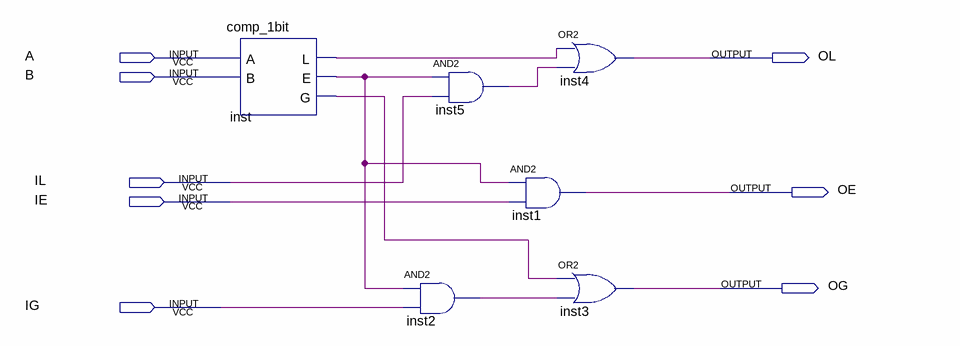
[diagram p0: schematic sheet]
// Quartus schematic cascade_comp_1bit.bdf as structural Verilog: 6 symbols, 8 pins
module cascade_comp_1bit (
  input  A,
  input  B,
  input  IL,
  input  IE,
  input  IG,
  output OL,
  output OE,
  output OG
);

  wire inst2_out, inst5_out, inst_e, inst_g, inst_l;

  comp_1bit inst (.A(A), .B(B), .L(inst_l), .E(inst_e), .G(inst_g));
  and inst5 (inst5_out, inst_e, IL);
  and inst2 (inst2_out, inst_e, IG);
  and inst1 (OE, inst_e, IE);
  or inst4 (OL, inst_l, inst5_out);
  or inst3 (OG, inst_g, inst2_out);
endmodule
